# Altium schematic sheet UiBoard.SchDoc
size A3
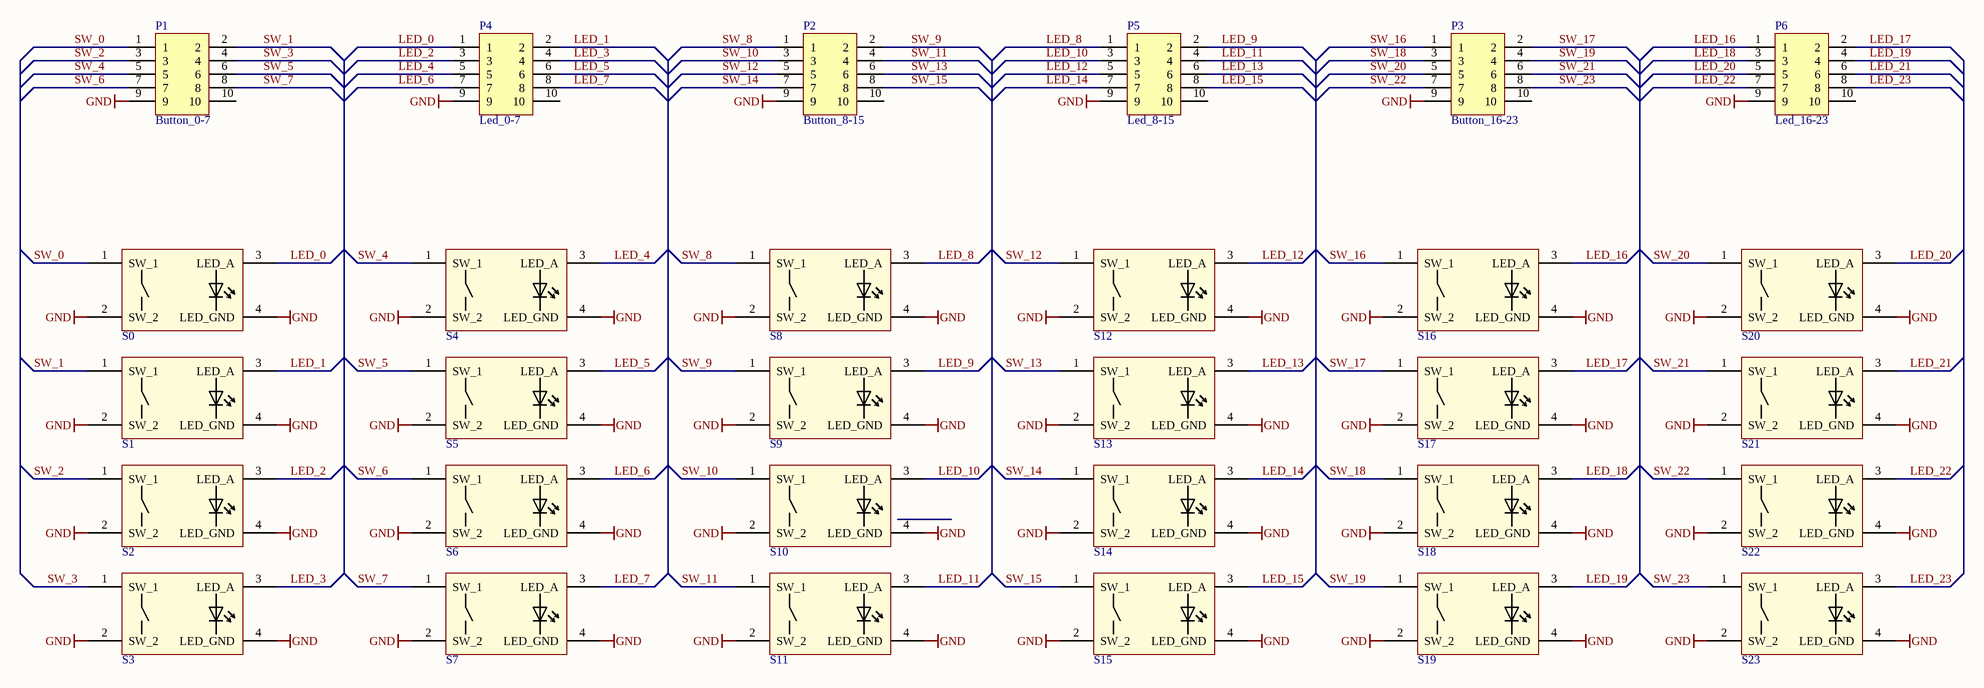
[diagram p0: UiBoard.SchDoc]

## Parts
P1  value Button_0-7  [10 pol Header tilted]  (hidden comment: 10 pol Header)
P2  value Button_8-15  [10 pol Header tilted]  (hidden comment: 10 pol Header)
P3  value Button_16-23  [10 pol Header tilted]  (hidden comment: 10 pol Header)
P4  value Led_0-7  [10 pol Header tilted]  (hidden comment: 10 pol Header)
P5  value Led_8-15  [10 pol Header tilted]  (hidden comment: 10 pol Header)
P6  value Led_16-23  [10 pol Header tilted]  (hidden comment: 10 pol Header)
S0  Switch + LED  [Marquardt Taster 6425]  (value not drawn)
S1  Switch + LED  [Marquardt Taster 6425]  (value not drawn)
S2  Switch + LED  [Marquardt Taster 6425]  (value not drawn)
S3  Switch + LED  [Marquardt Taster 6425]  (value not drawn)
S4  Switch + LED  [Marquardt Taster 6425]  (value not drawn)
S5  Switch + LED  [Marquardt Taster 6425]  (value not drawn)
S6  Switch + LED  [Marquardt Taster 6425]  (value not drawn)
S7  Switch + LED  [Marquardt Taster 6425]  (value not drawn)
S8  Switch + LED  [Marquardt Taster 6425]  (value not drawn)
S9  Switch + LED  [Marquardt Taster 6425]  (value not drawn)
S10  Switch + LED  [Marquardt Taster 6425]  (value not drawn)
S11  Switch + LED  [Marquardt Taster 6425]  (value not drawn)
S12  Switch + LED  [Marquardt Taster 6425]  (value not drawn)
S13  Switch + LED  [Marquardt Taster 6425]  (value not drawn)
S14  Switch + LED  [Marquardt Taster 6425]  (value not drawn)
S15  Switch + LED  [Marquardt Taster 6425]  (value not drawn)
S16  Switch + LED  [Marquardt Taster 6425]  (value not drawn)
S17  Switch + LED  [Marquardt Taster 6425]  (value not drawn)
S18  Switch + LED  [Marquardt Taster 6425]  (value not drawn)
S19  Switch + LED  [Marquardt Taster 6425]  (value not drawn)
S20  Switch + LED  [Marquardt Taster 6425]  (value not drawn)
S21  Switch + LED  [Marquardt Taster 6425]  (value not drawn)
S22  Switch + LED  [Marquardt Taster 6425]  (value not drawn)
S23  Switch + LED  [Marquardt Taster 6425]  (value not drawn)

## Nets
GND: P1.9 P2.9 P3.9 P4.9 P5.9 P6.9 S0.2(SW_2) S0.4(LED_GND) S1.2(SW_2) S1.4(LED_GND) S2.2(SW_2) S2.4(LED_GND) S3.2(SW_2) S3.4(LED_GND) S4.2(SW_2) S4.4(LED_GND) S5.2(SW_2) S5.4(LED_GND) S6.2(SW_2) S6.4(LED_GND) S7.2(SW_2) S7.4(LED_GND) S8.2(SW_2) S8.4(LED_GND) S9.2(SW_2) S9.4(LED_GND) S10.2(SW_2) S10.4(LED_GND) S11.2(SW_2) S11.4(LED_GND) S12.2(SW_2) S12.4(LED_GND) S13.2(SW_2) S13.4(LED_GND) S14.2(SW_2) S14.4(LED_GND) S15.2(SW_2) S15.4(LED_GND) S16.2(SW_2) S16.4(LED_GND) S17.2(SW_2) S17.4(LED_GND) S18.2(SW_2) S18.4(LED_GND) S19.2(SW_2) S19.4(LED_GND) S20.2(SW_2) S20.4(LED_GND) S21.2(SW_2) S21.4(LED_GND) S22.2(SW_2) S22.4(LED_GND) S23.2(SW_2) S23.4(LED_GND)
LED_0: P4.1 S0.3(LED_A)
LED_1: P4.2 S1.3(LED_A)
LED_2: P4.3 S2.3(LED_A)
LED_3: P4.4 S3.3(LED_A)
LED_4: P4.5 S4.3(LED_A)
LED_5: P4.6 S5.3(LED_A)
LED_6: P4.7 S6.3(LED_A)
LED_7: P4.8 S7.3(LED_A)
LED_8: P5.1 S8.3(LED_A)
LED_9: P5.2 S9.3(LED_A)
LED_10: P5.3 S10.3(LED_A)
LED_11: P5.4 S11.3(LED_A)
LED_12: P5.5 S12.3(LED_A)
LED_13: P5.6 S13.3(LED_A)
LED_14: P5.7 S14.3(LED_A)
LED_15: P5.8 S15.3(LED_A)
LED_16: P6.1 S16.3(LED_A)
LED_17: P6.2 S17.3(LED_A)
LED_18: P6.3 S18.3(LED_A)
LED_19: P6.4 S19.3(LED_A)
LED_20: P6.5 S20.3(LED_A)
LED_21: P6.6 S21.3(LED_A)
LED_22: P6.7 S22.3(LED_A)
LED_23: P6.8 S23.3(LED_A)
SW_0: P1.1 S0.1(SW_1)
SW_1: P1.2 S1.1(SW_1)
SW_2: P1.3 S2.1(SW_1)
SW_3: P1.4 S3.1(SW_1)
SW_4: P1.5 S4.1(SW_1)
SW_5: P1.6 S5.1(SW_1)
SW_6: P1.7 S6.1(SW_1)
SW_7: P1.8 S7.1(SW_1)
SW_8: P2.1 S8.1(SW_1)
SW_9: P2.2 S9.1(SW_1)
SW_10: P2.3 S10.1(SW_1)
SW_11: P2.4 S11.1(SW_1)
SW_12: P2.5 S12.1(SW_1)
SW_13: P2.6 S13.1(SW_1)
SW_14: P2.7 S14.1(SW_1)
SW_15: P2.8 S15.1(SW_1)
SW_16: P3.1 S16.1(SW_1)
SW_17: P3.2 S17.1(SW_1)
SW_18: P3.3 S18.1(SW_1)
SW_19: P3.4 S19.1(SW_1)
SW_20: P3.5 S20.1(SW_1)
SW_21: P3.6 S21.1(SW_1)
SW_22: P3.7 S22.1(SW_1)
SW_23: P3.8 S23.1(SW_1)

Not connected (* = marked no-connect by the designer): P1 10; P2 10; P3 10; P4 10; P5 10; P6 10

## Library data of the parts
S0-S23 = Switch + LED: Marquardt Key Switch with LED - Type 6425; Published: 8-Jun-2000; LatestRevisionDate: 29-May-2009; LatestRevisionNote: IPC-7351 Footprint Added.; PackageReference: C1206; Publisher: Altium Limited; PackageDescription: Chip Capacitor
P1-P6 = 10 pol Header: LatestRevisionDate: 2012-06-14; Publisher: NONLINEAR LABS